# EAGLE design EasyCheck_CHIP_REV1 (EAGLE 9.4.0)
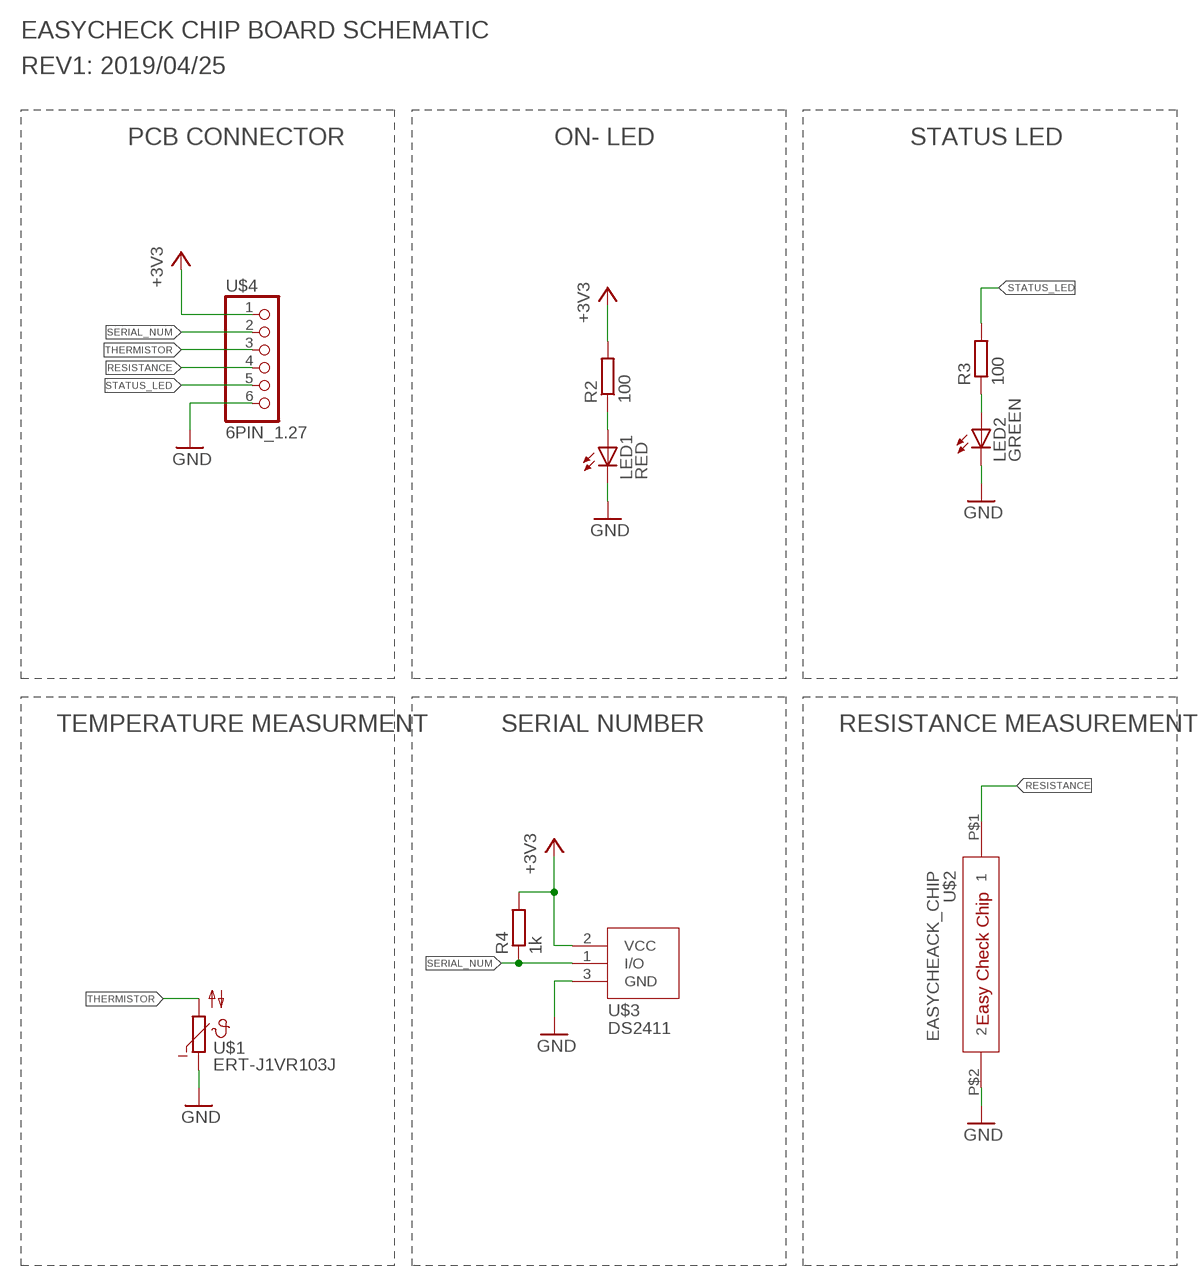
[diagram p0: schematic, sheet 1]

## Parts
LED1  RED  LEDCHIPLED_0603  [CHIPLED_0603]
LED2  GREEN  LEDCHIPLED_0603  [CHIPLED_0603]
R2  100  R-EU_R0402  [R0402]
R3  100  R-EU_R0402  [R0402]
R4  1k  R-EU_R0402  [R0402]
U$1  ERT-J1VR103J  NTC_SMD  [C0603K]
U$2  EASYCHEACK_CHIP  [EASYCHECK_CHIP]
U$3  DS2411  [SOT23]
U$4  6PIN_1.27  [6X1PIN_1.27]

## Nets
+3V3: R2.2 R4.2 U$3.2(VCC) U$4.1
GND: LED1.C LED2.C U$1.1 U$2.P$2 U$3.3(GND) U$4.6
N$2: LED1.A R2.1
N$3: LED2.A R3.1
RESISTANCE: U$2.P$1 U$4.4
SERIAL_NUM: R4.1 U$3.1(I/O) U$4.2
STATUS_LED: R3.2 U$4.5
THERMISTOR: U$1.2 U$4.3

## Notes on the sheet
- EASYCHECK CHIP BOARD SCHEMATIC
- REV1: 2019/04/25
- PCB CONNECTOR | ON- LED | STATUS LED
- TEMPERATURE MEASURMENT | SERIAL NUMBER | RESISTANCE MEASUREMENT

## Library data of the parts
LED1 LED2 = led:LED: LED OSRAM: - CHIPLED LG R971, LG N971, LY N971, LG Q971, LY Q971, LO R971, LY R971 LH N974, LH R974 LS Q976, LO Q976, LY Q976 LO Q996 - Hyper CHIPLED LW Q18S LB Q993, LB Q99A, LB R99A - SideLED LS A670, LO A670, LY A670, LG A670, LP A670 LB A673, LV A673, LT A673, LW A673 LH A674 LY A675 LS A676, LA A676, LO A676, LY A676, LW A676 LS A679, LY A679, LG A679 - Hyper Micro SIDELED® LS Y876, LA Y876, LO Y876, LY Y876 LT Y87S - SmartLED LW L88C, LW L88S LB L89C, LB L89S, LG L890 LS L89K, LO L89K, LY L89K LS L896, LA L896, LO L896, LY L896 - TOPLED LS T670, LO T670, LY T670, LG T670, LP T670 LSG T670, LSP T670, LSY T670, LOP T670, LYG T670 LG T671, LOG T671, LSG T671 LB T673, LV T673, LT T673, LW T673 LH T674 LS T676, LA T676, LO T676, LY T676, LB T676, LH T676, LSB T676, LW T676 LB T67C, LV T67C, LT T67C, LS T67K, LO T67K, LY T67K, LW E67C LS E67B, LA E67B, LO E67B, LY E67B, LB E67C, LV E67C, LT E67C LW T67C LS T679, LY T679, LG T679 LS T770, LO T770, LY T770, LG T770, LP T770 LB T773, LV T773, LT T773, LW T773 LH T774 LS E675, LA E675, LY E675, LS T675 LS T776, LA T776, LO T776, LY T776, LB T776 LHGB T686 LT T68C, LB T68C - Hyper Mini TOPLED® LB M676 - Mini TOPLED Santana® LG M470 LS M47K, LO M47K, LY M47K Source: http://www.osram.convergy.de LUXEON: - LUMILED® LXK2-PW12-R00, LXK2-PW12-S00, LXK2-PW14-U00, LXK2-PW14-V00 LXK2-PM12-R00, LXK2-PM12-S00, LXK2-PM14-U00 LXK2-PE12-Q00, LXK2-PE12-R00, LXK2-PE12-S00, LXK2-PE14-T00, LXK2-PE14-U00 LXK2-PB12-K00, LXK2-PB12-L00, LXK2-PB12-M00, LXK2-PB14-N00, LXK2-PB14-P00, LXK2-PB14-Q00 LXK2-PR12-L00, LXK2-PR12-M00, LXK2-PR14-Q00, LXK2-PR14-R00 LXK2-PD12-Q00, LXK2-PD12-R00, LXK2-PD12-S00 LXK2-PH12-R00, LXK2-PH12-S00 LXK2-PL12-P00, LXK2-PL12-Q00, LXK2-PL12-R00 Source: www.luxeon.com KINGBRIGHT: KA-3528ASYC Source: www.kingbright.com
R2-R4 = rcl:R-EU_: RESISTOR, European symbol; SPICEPREFIX: R
U$1 = EasyCheck:NTC_SMD
U$2 = EasyCheck:EASYCHEACK_CHIP
U$3 = EasyCheck:DS2411
U$4 = EasyCheck:6PIN_1.27

## Board
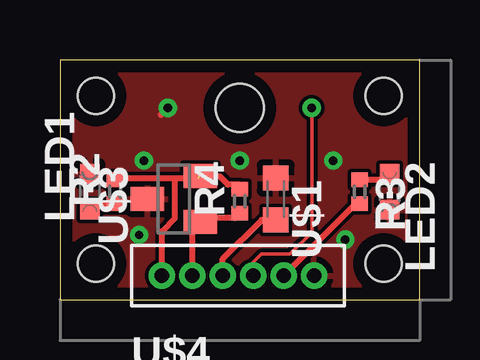
[diagram p1: board, top side]
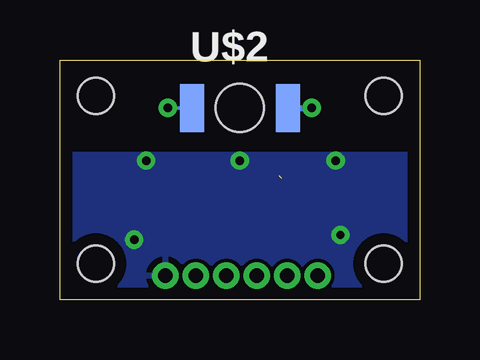
[diagram p2: board, bottom side, seen from below]

Size 15 x 10 mm. Coordinates in mm from the lower left corner, seen from the top.
Outline: 0,0 15,0 15,10 0,10 0,0
Copper layers (1*16): Top 0.035mm / dielectric 0.7mm / Bottom 0.035mm
Design rules "default *": minimum track width 6mil, minimum drill 0.35mm, track to track 6mil, track to pad 6mil, pad to pad 6mil, via to via 6mil, smd to smd 6mil, copper to edge 20mil, drill to drill 6mil, minimum pad ring 10mil, minimum via ring 8mil, stop-mask expansion 4mil, vias tented up to drill 0.4mm, thermal gap 10mil
Holes 1.5 mm at 1.5,8.5 1.5,1.5 13.5,1.5 13.5,8.5
Holes 2 mm at 7.5,8
tKeepout: area -0.2,6.1 to 15.1,10
bKeepout: area -0.2,6.1 to 15.2,10

### Footprints (pad centres in the part's own frame; a part is rotated, then mirrored left to right if it is on the bottom)
CHIPLED_0603 = smd 0.8 x 0.8: A 0,-0.75; C 0,0.75
R0402 = smd 0.6 x 0.7: 1 -0.5,0; 2 0.5,0
C0603K = smd 1.05 x 1.08: 1 -0.875,0; 2 0.875,0
EASYCHECK_CHIP = smd 1 x 2: P$1 -2,0; P$2 2,0
SOT23 = smd 1 x 1.4: 1 -0.95,-1.1; 2 0.95,-1.1; 3 0,1.1
6X1PIN_1.27 = drill 0.6: 1 0,0; 2 1.27,0; 3 2.54,0; 4 3.81,0; 5 5.08,0; 6 6.35,0

### Placement (x,y rotation side)
LED1  1.25,4.5 0 top
LED2  13.75,4.5 180 top
R2  2.3,4.5 90 top
R3  12.5,4.5 270 top
R4  7.5,4.1 90 top
U$1  9,4.2 270 top
U$2  7.5,8 0 bottom
U$3  4.75,4.2 90 top
U$4  4.25,1 0 top

### Tracks (layer width: path | path; a pad name or v marks a point on that pad's centre or on a via)
+3V3  (1 unrouted)
  Top 0.254: U$3.2 6.65,5.15 7,4.8 7.5,4.8 R4.2 | 5.75,5.05 4.8,5.05 | 4.8,5.05 2.35,5.05 R2.2 | U$4.1 4.25,2.85 4.8,3.4 4.8,5.05
GND  (via drill 0.35)
  Top 0.254: v4.5,8 4.2,7.7
  Bottom 0.254: U$2.P$2 v4.5,8
  other vias: 3.3,2.7 11.4,5.8 7.5,5.8 3.5,5.8 11.9,2.5
  pour Top: -0.2,10.1 -0.2,0 15,0 15,10.1
  pour Bottom: -0.2,6.1 -0.2,0 15,0 15,6.1
N$2
  Top 0.254: LED1.A 1.5,4 R2.1
N$3
  Top 0.152: LED2.A 13.5,5
  Top 0.254: 13.5,5 R3.1
RESISTANCE  (via drill 0.35)
  Top 0.152: v10.5,8 10.5,2.8 9.6,1.9 8.4,1.9 8.06,1.56 U$4.4
  Bottom 0.152: v10.5,8 9.57,8 9.51,7.97 U$2.P$1
SERIAL_NUM
  Top 0.254: U$4.2 5.52,2.9 U$3.1 6,3.4 7.3,3.4 R4.1
STATUS_LED
  Top 0.254: U$4.5 12.33,4 R3.2
THERMISTOR
  Top 0.254: U$4.3 6.79,1.69 8.43,3.33 U$1.2 8.62,3.7